# EAGLE design pmc1 (EAGLE 7.7.0)
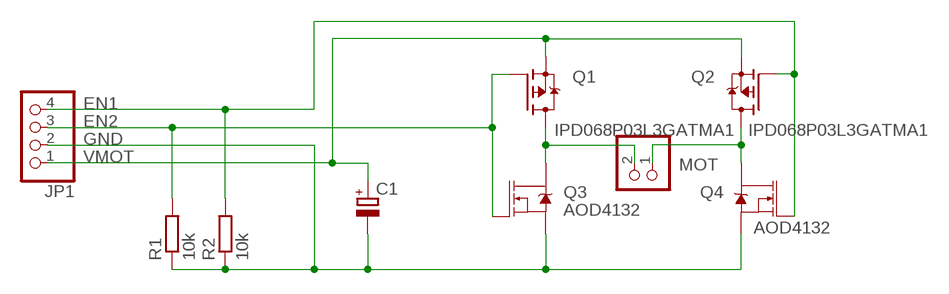
[diagram p0: schematic, sheet 1]

## Parts
C1  CPOL-EUE5-13  [E5-13]
JP1  PINHD-1X4/90  [1X04/90]
MOT  PINHD-1X2  [1X02]
Q1  IPD068P03L3GATMA1  FDD4141TO252  [TO252]
Q2  IPD068P03L3GATMA1  FDD4141TO252  [TO252]
Q3  AOD4132  MOSFET-NCH-FDD8780  [DPAK]
Q4  AOD4132  MOSFET-NCH-FDD8780  [DPAK]
R1  10k  R-EU_R0603  [R0603]
R2  10k  R-EU_R0603  [R0603]

## Nets
EN1: JP1.4 Q2.1(G) Q4.1(G) R2.2
EN2: JP1.3 Q1.1(G) Q3.1(G) R1.2
GND: C1.- JP1.2 Q3.3(S) Q4.3(S) R1.1 R2.1
N$1: MOT.2 Q1.3(D) Q3.4(D)
N$2: MOT.1 Q2.3(D) Q4.4(D)
VMOT: C1.+ JP1.1 Q1.2(S) Q2.2(S)

## Library data of the parts
C1 = rcl:CPOL-EU: POLARIZED CAPACITOR, European symbol
JP1 = pinhead:PINHD-1X4: PIN HEADER
MOT = pinhead:PINHD-1X2: PIN HEADER
Q1 Q2 = transistor-fet:FDD4141: P-Channel PowerTrench® MOSFET Source: FDD4141.pdf
Q3 Q4 = SparkFun-DiscreteSemi:MOSFET-NCH: N-channel MOSFETs Voltage controlled devices that allow control of high current outputs. SparkFun Products: SparkFun OpenScale <https://www.sparkfun.com/products/13261> SparkFun Digital Sandbox <https://www.sparkfun.com/products/12651> SparkFun Monster Moto Shield <https://www.sparkfun.com/products/10182> SparkFun MOSFET Power Controller <https://www.sparkfun.com/products/11214>; PROD_ID: TRANS-09984; VALUE: 35A/25V/8.5mΩ
R1 R2 = resistor:R-EU_: RESISTOR, European symbol

## Board
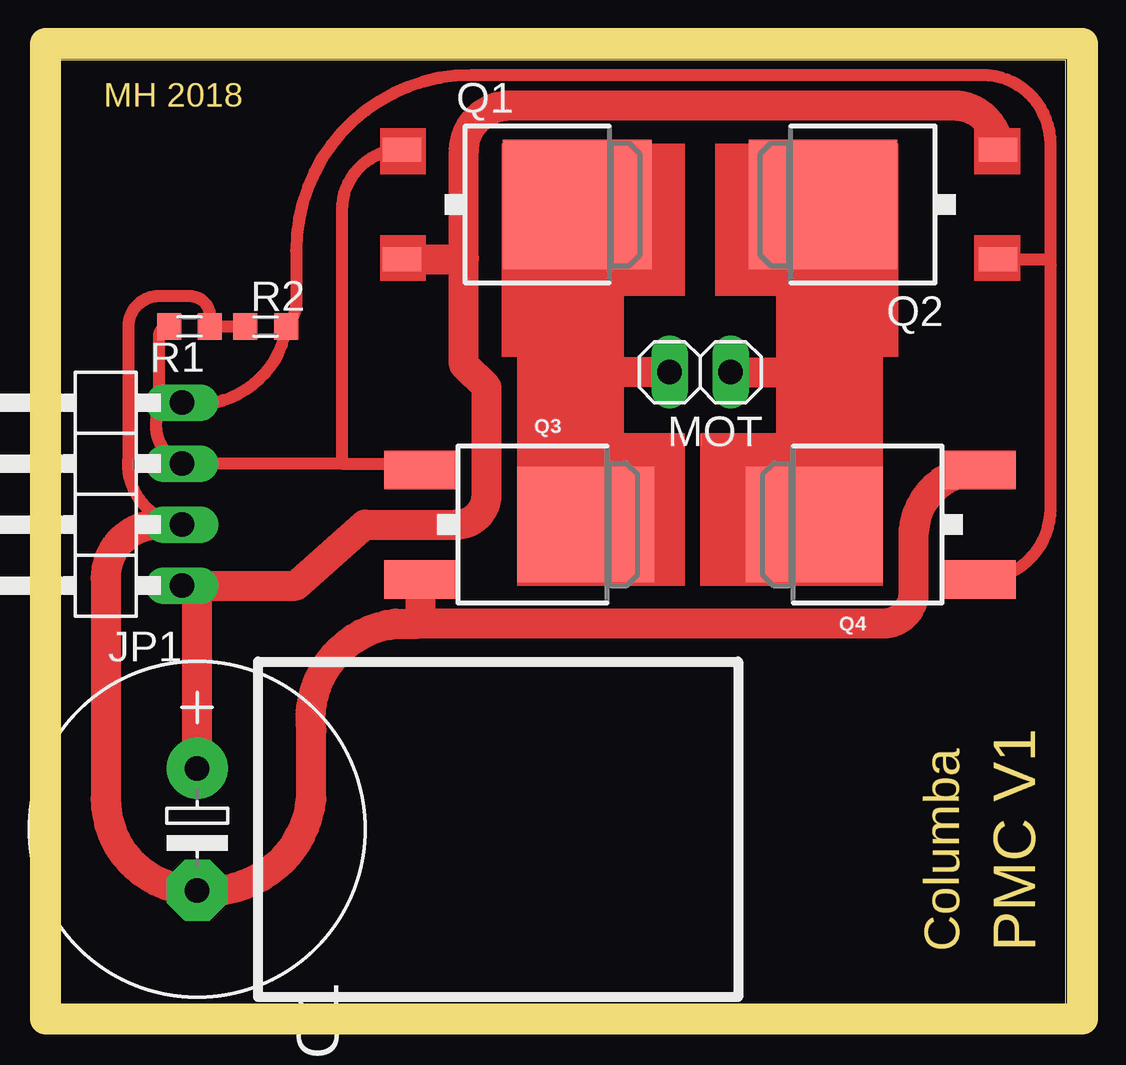
[diagram p1: board, top side]

Size 41.9 x 39.36 mm. Coordinates in mm from the lower left corner, seen from the top.
Outline: 0,0 41.9,0 41.9,39.36 0,39.36 0,0
Copper layers (1*16): Top 0.035mm / dielectric 1.5mm / Bottom 0.035mm
Design rules "default": minimum track width 10mil, minimum drill 24mil, track to track 8mil, track to pad 8mil, pad to pad 8mil, via to via 8mil, smd to smd 8mil, copper to edge 40mil, drill to drill 8mil, minimum pad ring 10mil, minimum via ring 8mil, stop-mask expansion 4mil, vias tented up to drill 0mil, thermal gap 10mil
Milling: 4 lines

### Footprints (pad centres in the part's own frame; a part is rotated, then mirrored left to right if it is on the bottom)
E5-13 = drill 1.016 pad 2.54: + -2.54,0 | drill 1.016 pad 2.54 octagon: - 2.54,0
1X04/90 = drill 1.016 long: 1 -3.81,-3.81; 2 -1.27,-3.81; 3 1.27,-3.81; 4 3.81,-3.81
1X02 = drill 1.016 long: 1 -1.27,0; 2 1.27,0
TO252 = smd 1 x 1.6: 1 -2.28,-4.8; 2 2.28,-4.8 | smd 5.4 x 6.2: 3 0,2.5
DPAK = smd 1.6 x 3: 1 -2.28,-5.31; 3 2.28,-5.31 | smd 4.826 x 5.715: 4 0,1.588
R0603 = smd 1 x 1.1: 1 -0.85,0; 2 0.85,0

### Placement (x,y rotation side)
C1  5.71,7.3 270 top
JP1  1.27,21.27 90 top
MOT  26.67,26.35 180 top
Q1  19.05,33.34 270 top
Q2  34.29,33.34 90 top
Q3  20.32,20 270 top
Q4  33.02,20 90 top
R1  5.4,28.26 180 top
R2  8.57,28.26 0 top

### Tracks (layer width: path | path; a pad name or v marks a point on that pad's centre or on a via)
EN1
  Top 0.5: Q4.1 arc90 41.27,20.67 41.27,30.8 | 41.27,30.8 41.27,35.88 arc90 38.42,38.73 17.14,38.73 arc90 9.84,31.43 9.84,29.27 arc-45 R2.2 9.42,28.16 arc-90 JP1.4 | Q2.1 41.02,31.06 arc-90 41.27,30.8
EN2
  Top 0.5: R1.2 arc90 4.13,27.84 4.13,24.77 arc90 JP1.3 11.75,22.54 | Q1.1 arc90 11.75,33.12 11.75,22.54 | 11.75,22.54 14.75,22.54 arc-90 Q3.1
GND
  Top 0.5: R2.1 R1.1 6.25,28.68 arc90 5.4,29.53 4.13,29.53 arc90 2.86,28.26 2.86,22.86 arc90 JP1.2
  Top 1.25: Q4.3 arc90 35.56,19.51 35.56,17.14 arc-90 34.29,15.88 14.92,15.88 | 5.4,20 JP1.2 4.13,20 arc90 1.91,17.78 1.91,8.57 arc90 C1.- arc90 10.48,8.57 10.48,11.43 arc-90 13.97,15.88 14.92,15.88 | Q3.3 15.01,15.96 arc-90 14.92,15.88
N$1
  Top 1.25: Q3.4 21.91,26.35 | 21.91,26.35 21.91,33.34 | 21.91,33.34 21.91,33.65 arc90 21.91,33.66 | MOT.2 21.91,26.35 | Q1.3 21.91,33.34
N$2
  Top 1.25: Q4.4 31.43,26.35 | 31.43,26.35 31.43,32.98 arc-90 Q2.3 | MOT.1 31.43,26.35
VMOT
  Top 1.25: JP1.1 5.71,17.46 | 5.71,17.46 9.84,17.46 12.7,20 16.51,20 arc90 17.78,21.27 17.78,25.72 16.83,26.67 16.83,31.11 | Q2.2 arc90 37.24,37.47 18.73,37.47 arc90 16.83,35.56 16.83,31.11 | Q1.2 16.77,31.06 arc90 16.83,31.11 | C1.+ 5.71,17.46
(copper drawn outside any net)
  shapes: Top area x12

### Text on the board
Milling: MH 2018 | Columba | PMC V1